# Altium project MAIN.PrjPcb (part 2 of 2)

## Sheet GATE_DRIVER.SchDoc
size A4; SheetNumber: 4; SheetTotal: 6
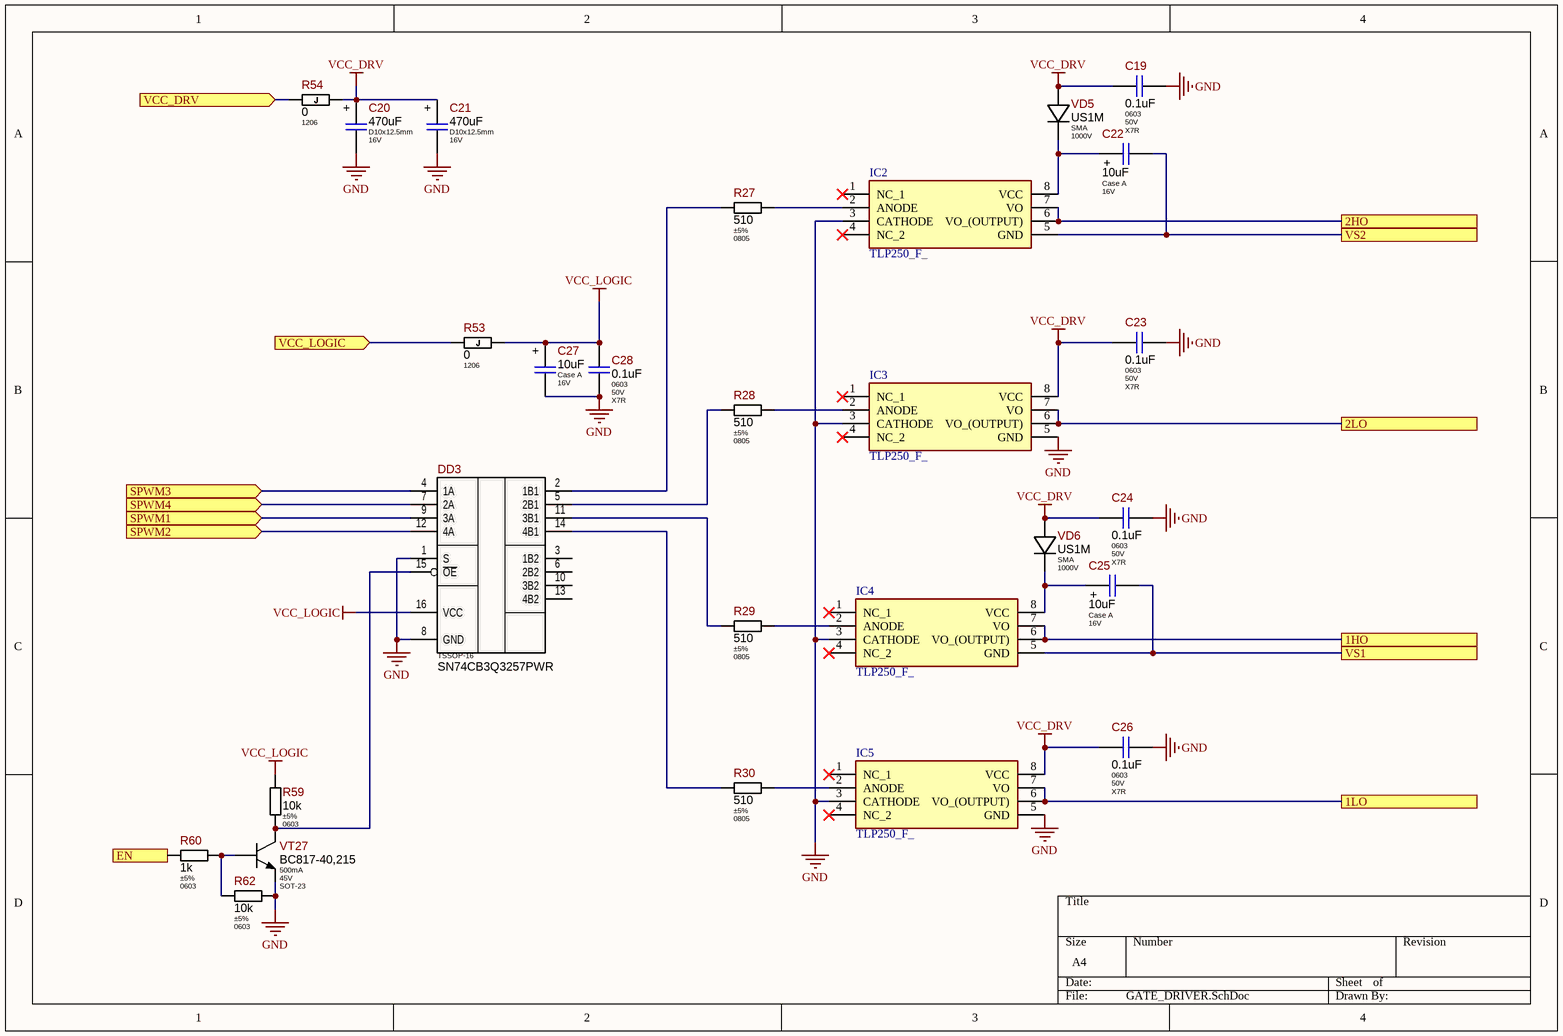
[diagram p3: GATE_DRIVER.SchDoc]

### Parts
C19  Package: 0603  Voltage: 50V  Dielectric Type: X7R  [C_CERAMIC_0603_MED]  (hidden comment: 0.1uF)
C20  value 470uF  Package: D10x12.5mm  Voltage: 16V  [CAP-AE-PTH-100D10x125H15]  (hidden comment: 470uFx16V)
C21  value 470uF  Package: D10x12.5mm  Voltage: 16V  [CAP-AE-PTH-100D10x125H15]  (hidden comment: 470uFx16V)
C22  Package: Case A  Voltage: 16V  [C_TANTAL_CASE_A_MED]  (hidden comment: 10uF)
C23  Package: 0603  Voltage: 50V  Dielectric Type: X7R  [C_CERAMIC_0603_MED]  (hidden comment: 0.1uF)
C24  Package: 0603  Voltage: 50V  Dielectric Type: X7R  [C_CERAMIC_0603_MED]  (hidden comment: 0.1uF)
C25  Package: Case A  Voltage: 16V  [C_TANTAL_CASE_A_MED]  (hidden comment: 10uF)
C26  Package: 0603  Voltage: 50V  Dielectric Type: X7R  [C_CERAMIC_0603_MED]  (hidden comment: 0.1uF)
C27  Package: Case A  Voltage: 16V  [C_TANTAL_CASE_A_MED]  (hidden comment: 10uF)
C28  Package: 0603  Voltage: 50V  Dielectric Type: X7R  [C_CERAMIC_0603_MED]  (hidden comment: 0.1uF)
DD3  SN74CB3Q3257PWR  [TSSOP-16]
IC2  TLP250_F_  [DIP762W60P254L966H485Q8N]
IC3  TLP250_F_  [DIP762W60P254L966H485Q8N]
IC4  TLP250_F_  [DIP762W60P254L966H485Q8N]
IC5  TLP250_F_  [DIP762W60P254L966H485Q8N]
R27  Tolerance: ±5%  Package: 0805  [R_ANY_CHIP_0805_MED]  (hidden comment: 510)
R28  Tolerance: ±5%  Package: 0805  [R_ANY_CHIP_0805_MED]  (hidden comment: 510)
R29  Tolerance: ±5%  Package: 0805  [R_ANY_CHIP_0805_MED]  (hidden comment: 510)
R30  Tolerance: ±5%  Package: 0805  [R_ANY_CHIP_0805_MED]  (hidden comment: 510)
R53  Package: 1206  [R_ANY_CHIP_1206_MED]  (hidden comment: 0)
R54  Package: 1206  [R_ANY_CHIP_1206_MED]  (hidden comment: 0)
R59  Tolerance: ±5%  Package: 0603  [R_ANY_CHIP_0603_MED]  (hidden comment: 10k)
R60  Tolerance: ±5%  Package: 0603  [R_ANY_CHIP_0603_MED]  (hidden comment: 1k)
R62  Tolerance: ±5%  Package: 0603  [R_ANY_CHIP_0603_MED]  (hidden comment: 10k)
VD5  Package: SMA  Voltage: 1000V  [SMA_MED]  (hidden comment: US1M)
VD6  Package: SMA  Voltage: 1000V  [SMA_MED]  (hidden comment: US1M)
VT27  Ic: 500mA  Vce: 45V  Package: SOT-23  [SOT-23_MED]  (hidden comment: BC817-40,215)

### Ports
1HO, 1LO, 2HO, 2LO, EN (in), SPWM1 (in), SPWM2 (in), SPWM3 (in), SPWM4 (in), VCC_DRV (in), VCC_LOGIC (in), VS1, VS2

### Nets
5V: R53.2 ; port VCC_LOGIC
12V: R54.2 ; port VCC_DRV
GND: C19.2 C20.2 C21.2 C23.2 C24.2 C26.2 C27.2 C28.1 DD3.1(S) DD3.8(GND) IC2.3(CATHODE) IC3.3(CATHODE) IC3.5(GND) IC4.3(CATHODE) IC5.3(CATHODE) IC5.5(GND) R62.1 VT27.2(E)
VCC_DRV: C19.1 C20.1 C21.1 C23.1 C24.1 C26.1 IC3.8(VCC) IC5.8(VCC) R54.1 VD5.AN VD6.AN
VCC_LOGIC: C27.1 C28.2 DD3.16(VCC) R53.1 R59.2
NetC22_1: C22.1 IC2.8(VCC) VD5.CA
NetC22_2: C22.2 IC2.5(GND) ; port VS2
NetC25_1: C25.1 IC4.8(VCC) VD6.CA
NetC25_2: C25.2 IC4.5(GND) ; port VS1
NetDD3_2: DD3.2(1B1) R27.1
NetDD3_4: DD3.4(1A) ; port SPWM3
NetDD3_5: DD3.5(2B1) R28.1
NetDD3_7: DD3.7(2A) ; port SPWM4
NetDD3_9: DD3.9(3A) ; port SPWM1
NetDD3_11: DD3.11(3B1) R29.1
NetDD3_12: DD3.12(4A) ; port SPWM2
NetDD3_14: DD3.14(4B1) R30.1
NetDD3_15: DD3.15(~{OE}) R59.1 VT27.3(C)
NetIC2_2: IC2.2(ANODE) R27.2
NetIC2_6: IC2.6(VO_(OUTPUT)) IC2.7(VO) ; port 2HO
NetIC3_2: IC3.2(ANODE) R28.2
NetIC3_6: IC3.6(VO_(OUTPUT)) IC3.7(VO) ; port 2LO
NetIC4_2: IC4.2(ANODE) R29.2
NetIC4_6: IC4.6(VO_(OUTPUT)) IC4.7(VO) ; port 1HO
NetIC5_2: IC5.2(ANODE) R30.2
NetIC5_6: IC5.6(VO_(OUTPUT)) IC5.7(VO) ; port 1LO
NetR60_1: R60.1 ; port EN
NetR60_2: R60.2 R62.2 VT27.1(B)

Not connected (* = marked no-connect by the designer): DD3 3(1B2) 6(2B2) 10(3B2) 13(4B2); IC2 1(NC_1)* 4(NC_2)*; IC3 1(NC_1)* 4(NC_2)*; IC4 1(NC_1)* 4(NC_2)*; IC5 1(NC_1)* 4(NC_2)*

### Notes on the sheet
- (in symbol EXR471M16B) +
- (in symbol TAJA106K016RNJ) +

### Library data of the parts
C19 C23 C24 C26 C28 = CL10B104KB8NNND: 100nF 50V X7R ±10% 0603 Ceramic Capacitor RoHS; Manufacturer: Samsung Electro-Mechanics; Ajax_1C_ID: 21313; Ajax_1C_PN: 100nF 50V X7R 10% 0603 CL10B104KB8NNND ceramic capacitor SMD; Ajax_1С_Status: Substitution; Standard Lead Time: 18 Weeks; Component Status: Released; Replacement: CL10B104KB8NNNC; GUID_1C: f1fd6399-ca68-11ea-ab63-0050569f2651; Value: 0.1uF; Part Number: CL10B104KB8NNND; Part Type: Ceramic / X7R / 0603; Component Type: SMD; Temperature Range: -55°C ~ 125°C; Tolerance: ±10%; ComponentLink1URL: https://media.digikey.com/pdf/Data%20Sheets/Samsung%20PDFs/CL_Series_MLCC_ds.pdf; Supplier 1: Digi-Key; Supplier Part Number 1: CL10B104KB8NNND-ND; Price: 0,0039378; ComponentLink1Description: Datasheet
C20 C21 = EXR471M16B: 470uF 16V D10x12.5mm Electrolytic Low Impedance; Manufacturer: Hitano; Ajax_1C_ID: 15747; Ajax_1C_PN: 470uF 16V 10x12.5mm EXR EXR471M16B-Hitano pcs; Ajax_1С_Status: Mass Production; Standard Lead Time: NONE; Component Status: Released; Tolerance: ±20%; GUID_1C: 3364ee07-6280-11e9-ab4f-0050569f2651; Part Number: EXR471M16B; Part Type: Aluminum; Component Type: PTH; Temperature Range: -40°C ~ 105°C; Dielectric Type: NONE; ComponentLink1URL: https://www.hitano.com.tw/wp-content/uploads/doc/EXR_20200408.pdf; Replacement: NONE; Price: 0,045; ComponentLink1Description: Datasheet
C22 C25 C27 = TAJA106K016RNJ: 10uF 16V ±10% Case A Tantalum Capacitors, 3Ohm; Manufacturer: AVX; Ajax_1C_ID: 6332; Ajax_1C_PN: 10uF 16V case A TAJA106K016RNJ-AVX Ceramic Capacitor SMD RoHS; Ajax_1С_Status: RND Only; Standard Lead Time: 25 Weeks; Component Status: Released; Dielectric Type: NONE; GUID_1C: b7f6d7ac-ecab-11e4-ad28-a45d36c4a9e5; Value: 10uF; Part Number: TAJA106K016RNJ; Part Type: Tantalum; Component Type: SMD; Temperature Range: -55°C ~ 125°C; Tolerance: ±10%; ComponentLink1URL: https://eu.mouser.com/datasheet/2/40/AVXC_S_A0011957049_1-2538439.pdf; Supplier 1: Mouser; Supplier Part Number 1: 581-TAJA106K016R; Replacement: NONE; Price: 0,06584713; ComponentLink1Description: Datasheet
DD3 = SN74CB3Q3257PWR: 4-Bit 1-of-2 FET Multiplexer/Demultiplexer 2.5V/3.3V Low-Voltage High-Bandwidth Bus Switch; Manufacturer: Texas Instruments; Ajax_1C_ID: 9738; Ajax_1C_PN: SN74CB3Q3257PWR микросхема; Ajax_1С_Status: RND Only; Standard Lead Time: 8 Weeks; Component Status: Released; Replacement: NONE; GUID_1C: ccf75652-0f3c-11e7-82d9-d8cb8a9acc66; Package: TSSOP-16; Part Number: SN74CB3Q3257PWR; Part Type: Logic / Multiplexer/Demultiplexer; Component Type: SMD; Temperature Range: -40°C ~ 85°C; ComponentLink1URL: http://www.ti.com/lit/ds/symlink/sn74cb3q3257.pdf; Supplier 1: Digi-Key; Supplier Part Number 1: 296-19138-1-ND; Price: 0,337; ComponentLink1Description: Datasheet
IC2-IC5 = TLP250_F_: Integrated Circuit; Manufacturer_Name: Toshiba; Manufacturer_Part_Number: TLP250(F); Datasheet Link: https://datasheet.datasheetarchive.com/originals/distributors/Datasheets-DGA20/76463.pdf; Height: 4.85mm; Mouser Part Number: 757-TLP250(F); Mouser Price/Stock: https://www.mouser.co.uk/ProductDetail/Toshiba/TLP250F?qs=f0GatGUIxV2cDxQrFeprhQ%3D%3D; Arrow Part Number: TLP250(F); Arrow Price/Stock: https://www.arrow.com/en/products/tlp250-f/toshiba
R27-R30 = CRCW0805510RJNEA: 510 Ohms ±5%, 1/8W 0805 Thick Film Resistor; Manufacturer: Vishay; Ajax_1C_ID: 9454; Ajax_1C_PN: 510R 5% 0805 Resistors SMD RoHS; Ajax_1С_Status: RND Only; Power Rating: 0.125W; Voltage: 150V; Component Status: Released; Temperature Stability: ±200ppm/°C; Replacement: NONE; GUID_1C: 51b8dd24-e3a6-11e6-82a2-d8cb8a9acc66; Value: 510; Part Number: CRCW0805510RJNEA; Component Type: SMD; Part Type: Thick Film; Temperature Range: -55°C ~ 155°C; ComponentLink1URL: https://eu.mouser.com/datasheet/2/427/dcrcwe3-1762152.pdf; Supplier 1: Mouser; Supplier Part Number 1: 71-CRCW0805510RJNEA; Price: 0,09; ComponentLink1Description: Datasheet
R53 R54 = RC1206JR-070RL: 0 Ohms Jumper, 1/4W 1206 Thick Film Resistor; Manufacturer: Yageo; Tolerance: ±5%; Ajax_1C_ID: 5515; Ajax_1C_PN: 0R 5% 1206 Resistors SMD RoHS; Ajax_1С_Status: Mass Production; Power Rating: 0.25W; Voltage: 200V; Component Status: Released; Temperature Stability: NONE; GUID_1C: 96b6e750-6b2e-11e4-9c1d-a45d36c4a9e5; Value: 0; Part Number: RC1206JR-070RL; Component Type: SMD; Part Type: Thick Film; Temperature Range: -55°C ~ 155°C; ComponentLink1URL: https://eu.mouser.com/datasheet/2/447/PYu_RC_Group_51_RoHS_L_10-1664068.pdf; Supplier 1: Digi-Key; Supplier Part Number 1: 311-0.0ERTR-ND; Replacement: NONE; Price: 0,0018; ComponentLink1Description: Datasheet
R59 R62 = RC0603JR-0710KL: 10 kOhms ±5%, 1/10W 0603 Thick Film Resistor; Manufacturer: Yageo; Ajax_1C_ID: 2860; Ajax_1C_PN: 10k 5% 0603 Resistors SMD RoHS; Ajax_1С_Status: Mass Production; Power Rating: 0.1W; Voltage: 75V; Component Status: Released; Temperature Stability: ±100ppm/°C; Replacement: NONE; GUID_1C: df4c2852-e567-11e2-9779-6c626deda1bb; Value: 10k; Part Number: RC0603JR-0710KL; Component Type: SMD; Part Type: Thick Film; Temperature Range: -55°C ~ 155°C; ComponentLink1URL: https://eu.mouser.com/datasheet/2/447/PYu_RC_Group_51_RoHS_L_10-1664068.pdf; Supplier 1: Digi-Key; Supplier Part Number 1: 311-10KGRTR-ND; Price: 0,0006; ComponentLink1Description: Datasheet
R60 = RC0603JR-071KL: 1 kOhms ±5%, 1/10W 0603 Thick Film Resistor; Manufacturer: Yageo; Ajax_1C_ID: 28124; Ajax_1C_PN: 1k 5% 0603 Resistors SMD RoHS; Ajax_1С_Status: Mass Production; Power Rating: 0.1W; Voltage: 75V; Component Status: Released; Temperature Stability: ±100ppm/°C; Replacement: NONE; GUID_1C: fbc5fd6b-8d66-11eb-ab70-0050569f2651; Value: 1k; Part Number: RC0603JR-071KL; Component Type: SMD; Part Type: Thick Film; Temperature Range: -55°C ~ 155°C; ComponentLink1URL: https://eu.mouser.com/datasheet/2/447/PYu_RC_Group_51_RoHS_L_11-1984063.pdf; Supplier 1: Digi-Key; Supplier Part Number 1: 311-1.0KGRTR-ND; Price: 0,00072; ComponentLink1Description: Datasheet
VD5 VD6 = US1M: Diode Standard 1000V 1A, 75ns, SMA; Manufacturer: Diodec Semiconductor; Ajax_1C_ID: 20461; Ajax_1C_PN: US1M-DIO 1.0A 1000V 75ns, диод; Ajax_1С_Status: Mass Production; Component Status: Released; Vf: 1.7V @ 1A; Replacement: NONE; GUID_1C: 3d137b04-96a6-11ea-ab61-0050569f2651; Part Number: US1M; Part Type: General; Component Type: SMD; Marking: US1M; Current: 1A; Temperature Range: -50°C ~ 150°C; ComponentLink1URL: https://diotec.com/request/datasheet/us1a.pdf; Supplier 1: Arrow; Supplier Part Number 1: US1M; Price: 0,02875902; ComponentLink1Description: Datasheet
VT27 = BC817-40,215: 45V, 500mA NPN General Purpose Transistor; Manufacturer: Nexperia USA; Ajax_1C_ID: 6645; Ajax_1C_PN: BC817-40,215 : NPN, sot-23 транзистор; Ajax_1С_Status: Mass Production; Component Status: Released; Standard Lead Time: 4 Weeks; Replacement: NONE; GUID_1C: 5d499e81-0f64-11e5-ad28-a45d36c4a9e5; Part Number: BC817-40,215; Part Type: NPN; Component Type: SMD; Temperature Range: -65°C ~ 150°C; ComponentLink1URL: https://eu.mouser.com/datasheet/2/916/BC817_SER-1480622.pdf; Supplier 1: Mouser; Supplier Part Number 1: 771-BC817-40-T/R; Price: 0,094; ComponentLink1Description: Datasheet

## Sheet REVERSE_POLARITY_PROT.SchDoc: =DocumentName
size A4; Author: Starovit; CompanyName: "AS Manufacturing" LLC; Organization: "AS Manufacturing" LLC; Address1: 5 Sklyarenka St.; Address2: Kyiv 04073; Address3: Ukraine; Address4: https://ajax.systems/en/; Revision: v1; SheetNumber: 5; SheetTotal: 8; Product name: INVERTOR; Internal reference: 001; Head: INVERTOR.001.v1; PCB_Designator: INVERTOR.001.v1; Template_version: 1.0.1
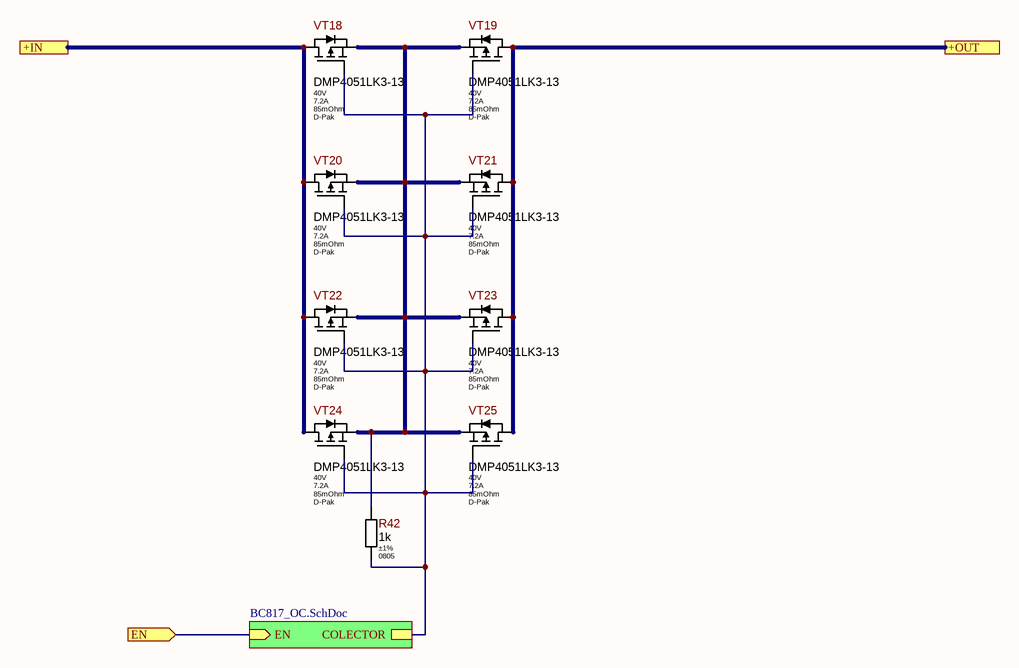
[diagram p4: REVERSE_POLARITY_PROT.SchDoc]

### Parts
R42  Tolerance: ±1%  Package: 0805  [R_ANY_CHIP_0805_MED]  (hidden comment: 1k)
VT18  Vds: 40V  Id: 7.2A  Rds: 85mOhm  Package: D-Pak  [DPAK_REC]  (hidden comment: DMP4051LK3-13)
VT19  Vds: 40V  Id: 7.2A  Rds: 85mOhm  Package: D-Pak  [DPAK_REC]  (hidden comment: DMP4051LK3-13)
VT20  Vds: 40V  Id: 7.2A  Rds: 85mOhm  Package: D-Pak  [DPAK_REC]  (hidden comment: DMP4051LK3-13)
VT21  Vds: 40V  Id: 7.2A  Rds: 85mOhm  Package: D-Pak  [DPAK_REC]  (hidden comment: DMP4051LK3-13)
VT22  Vds: 40V  Id: 7.2A  Rds: 85mOhm  Package: D-Pak  [DPAK_REC]  (hidden comment: DMP4051LK3-13)
VT23  Vds: 40V  Id: 7.2A  Rds: 85mOhm  Package: D-Pak  [DPAK_REC]  (hidden comment: DMP4051LK3-13)
VT24  Vds: 40V  Id: 7.2A  Rds: 85mOhm  Package: D-Pak  [DPAK_REC]  (hidden comment: DMP4051LK3-13)
VT25  Vds: 40V  Id: 7.2A  Rds: 85mOhm  Package: D-Pak  [DPAK_REC]  (hidden comment: DMP4051LK3-13)

### Sub-sheets
OC = BC817_OC.SchDoc (file not in this document): EN (in), COLECTOR

### Ports
+IN, +OUT, EN (in)

### Nets
+V_BRIDGE: VT19.2(D) VT21.2(D) VT23.2(D) VT25.2(D) ; port +OUT
+VBAT: VT18.2(D) VT20.2(D) VT22.2(D) VT24.2(D) ; port +IN
cEN_BRIDGE_POWER: port EN, sheet OC/EN
NetR42_1: R42.1 VT18.1(G) VT19.1(G) VT20.1(G) VT21.1(G) VT22.1(G) VT23.1(G) VT24.1(G) VT25.1(G) ; sheet OC/COLECTOR
NetR42_2: R42.2 VT18.3(S) VT19.3(S) VT20.3(S) VT21.3(S) VT22.3(S) VT23.3(S) VT24.3(S) VT25.3(S)

### Notes on the sheet
- Title
- Product:
- Project:
- Size:
- Date:
- Variant:
- A4
- Authors:
- Time:
- Sheet
- of
- Revision:
- @Vitech_ua
- Commit:

### Library data of the parts
R42 = RC0805FR-071KL: 1 kOhms ±1%, 1/8W 0805 Thick Film Resistor; Manufacturer: Yageo; Ajax_1C_ID: 8520; Ajax_1C_PN: 1k 1% 0805 Resistors SMD RoHS; Ajax_1С_Status: Mass Production; Power Rating: 0.125W; Voltage: 150V; Component Status: Released; Temperature Stability: ±100ppm/°C; Replacement: NONE; GUID_1C: 0c53a8ec-2890-11e6-81ae-d8cb8a9acc66; Value: 1k; Part Number: RC0805FR-071KL; Component Type: SMD; Part Type: Thick Film; Temperature Range: -55°C ~ 155°C; ComponentLink1URL: https://eu.mouser.com/datasheet/2/447/PYu_RC_Group_51_RoHS_L_10-1664068.pdf; Supplier 1: Digi-Key; Supplier Part Number 1: 311-1.00KCRTR-ND; Price: 0,0014; ComponentLink1Description: Datasheet
VT18-VT25 = DMP4051LK3-13: -40V, -7.2A max P-Channel Enhancement MOSFET, 59mOhm @ Vgs = -4.5V; Manufacturer: Diodes Incorporated; Ajax_1C_ID: 18605; Ajax_1C_PN: DMP4051LK3 40V, 0,05Ohm P-chanel Power HEXFET; Ajax_1С_Status: Mass Production; Component Status: Released; Standard Lead Time: 30 Weeks; Replacement: NONE; GUID_1C: 9abe91dd-36a9-11ea-ab5a-0050569f2651; Part Number: DMP4051LK3-13; Part Type: P-Channel; Component Type: SMD; Temperature Range: -55°C ~ 150°C; ComponentLink1URL: https://www.diodes.com/assets/Datasheets/DMP4051LK3.pdf; Supplier 1: Digi-Key; Supplier Part Number 1: DMP4051LK3-13DITR-ND; Price: 0,1628; ComponentLink1Description: Datasheet

## Sheet EXT_U_DET.SchDoc: =DocumentName
size A4; Author: Starovit; CompanyName: "AS Manufacturing" LLC; Organization: "AS Manufacturing" LLC; Address1: 5 Sklyarenka St.; Address2: Kyiv 04073; Address3: Ukraine; Address4: https://ajax.systems/en/; Revision: v1; SheetNumber: 6; SheetTotal: 7; Product name: INVERTOR; Internal reference: 001; Head: INVERTOR.001.v1; PCB_Designator: INVERTOR.001.v1; Template_version: 1.0.1
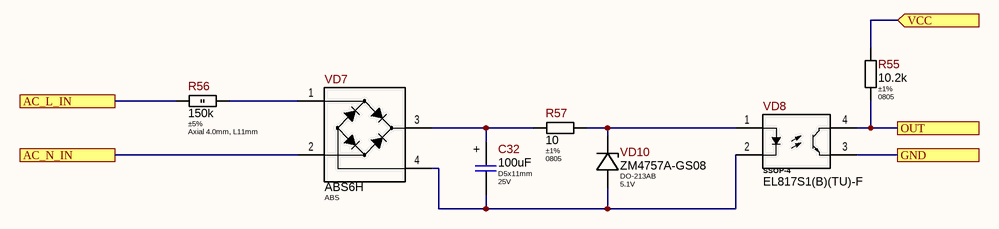
[diagram p5: EXT_U_DET.SchDoc]

### Parts
C32  value 100uF  Package: D5x11mm  Voltage: 25V  [CAP-AE-PTH-50D05x110H15]  (hidden comment: 100uFx25V)
R55  Tolerance: ±1%  Package: 0805  [R_ANY_CHIP_0805_MED]  (hidden comment: 10.2k)
R56  Tolerance: ±5%  Package: Axial 4.0mm, L11mm  [MOR200S-Series]  (hidden comment: 150k)
R57  Tolerance: ±1%  Package: 0805  [R_ANY_CHIP_0805_MED]  (hidden comment: 10)
VD7  Package: ABS  [ABSxx-Series]  (hidden comment: ABS6H)
VD8  Package: SSOP-4  [EL-817S1-(x)(xx)]  (hidden comment: EL817S1(B)(TU)-F)
VD10  Voltage: 5.1V  [DO-213AB]  (hidden comment: ZM4757A-GS08)

### Ports
AC_L_IN, AC_N_IN, GND, OUT, VCC (in)

### Nets
3V3: R55.1 ; port VCC
GND: VD8.3(Emitter) ; port GND
dEXT_U_DET: R55.2 VD8.4(Collector) ; port OUT
EXT_AC_L: R56.1 ; port AC_L_IN
EXT_AC_N: VD7.2 ; port AC_N_IN
NetC32_1: C32.1 R57.1 VD7.3(+)
NetC32_2: C32.2 VD7.4(-) VD8.2(Cathode) VD10.AN
NetR56_2: R56.2 VD7.1
NetR57_2: R57.2 VD8.1(Anode) VD10.CA

### Notes on the sheet
- Title
- Product:
- Project:
- Size:
- Date:
- Variant:
- A4
- Authors:
- Time:
- Sheet
- of
- Revision:
- @Vitech_ua
- Commit:
- (in symbol KRM-025V101MC110-T/A2) +

### Library data of the parts
C32 = KRM-025V101MC110-T/A2: 100uF 25V ±20% D5x11mm 105℃ Aluminum Electrolytic Capacitor; Manufacturer: Koshin; Ajax_1C_ID: 55676; Ajax_1C_PN: 100uF 25V 20% 5x11mm KRM-025V101MC110-T/A2 Koshin Capacitors SMD RoHS; Ajax_1С_Status: RND Only; Standard Lead Time: NONE; Component Status: Released; GUID_1C: cc76a443-6c07-11ed-a366-005056994834; Part Number: KRM-025V101MC110-T/A2; Part Type: Aluminum; Component Type: PTH; Temperature Range: -40°C ~ 105°C; Tolerance: ±20%; Dielectric Type: NONE; ComponentLink1URL: \\altiumdb.ajax.local\files\Datasheet\Capacitor\Koshin - KRM Series.pdf; Replacement: NONE; Price: 0; ComponentLink1Description: Datasheet
R55 = RC0805FR-0710K2L: 10.2 kOhms ±1%, 1/8W 0805 Thick Film Resistor; Manufacturer: Yageo; Ajax_1C_ID: 13943; Ajax_1C_PN: 10.2k 1% 0805 Resistors SMD RoHS; Ajax_1С_Status: Mass Production; Power Rating: 0.125W; Voltage: 150V; Component Status: Released; Temperature Stability: ±100ppm/°C; Replacement: NONE; GUID_1C: 8bc9d0ce-c58a-11e8-ab47-0050569f2651; Value: 10.2k; Part Number: RC0805FR-0710K2L; Component Type: SMD; Part Type: Thick Film; Temperature Range: -55°C ~ 155°C; ComponentLink1URL: https://eu.mouser.com/datasheet/2/447/PYu_RC_Group_51_RoHS_L_10-1664068.pdf; Supplier 1: Digi-Key; Supplier Part Number 1: 311-10.2KCRTR-ND; Price: 0,0014; ComponentLink1Description: Datasheet
R56 = MOR200SJTB-10R: 150k Ohm ±5%, 2W d4.0mm L11mm Axial Through Hole, Metal Oxide Resistor, Al2O3; Manufacturer: Hitano; Ajax_1C_ID: 17914; Ajax_1C_PN: 150k 5% 2W (MOR200SJTB-10R-Hitano) резистор выводной pcs; Ajax_1С_Status: RND Only; Voltage: 500V; Component Status: Released; Temperature Stability: ±250ppm/°C; Replacement: NONE; GUID_1C: 857e103f-078d-11ea-ab58-0050569f2651; Value: 150k; Part Number: MOR200SJTB-10R; Component Type: PTH; Part Type: Metal Oxide Film; Power Rating: 2W; Temperature Range: -55°C ~ 200°C; ComponentLink1URL: \\altiumdb.ajax.local\files\Datasheet\Passive\MOR_20160329.pdf; Supplier 1: RKS; Supplier Part Number 1: 13878; Price: 0,05250406; ComponentLink1Description: Datasheet
R57 = RC0805FR-0710RL: 10 Ohms ±1%, 1/8W 0805 Thick Film Resistor; Manufacturer: Yageo; Ajax_1C_ID: 9628; Ajax_1C_PN: 10R 1% 0805 Resistors SMD RoHS; Ajax_1С_Status: Mass Production; Power Rating: 0.125W; Voltage: 150V; Component Status: Released; Temperature Stability: ±200ppm/°C; Replacement: NONE; GUID_1C: 1aa18cd2-0589-11e7-82cd-d8cb8a9acc66; Value: 10; Part Number: RC0805FR-0710RL; Component Type: SMD; Part Type: Thick Film; Temperature Range: -55°C ~ 155°C; ComponentLink1URL: https://eu.mouser.com/datasheet/2/447/PYu_RC_Group_51_RoHS_L_10-1664068.pdf; Supplier 1: Digi-Key; Supplier Part Number 1: 311-10.0CRTR-ND; Price: 0,0014; ComponentLink1Description: Datasheet
VD7 = ABS6H: 1A, 600V Standard Bridge Rectifier, ABS Package; Manufacturer: Taiwan Semiconductor; Ajax_1C_ID: 34652; Ajax_1C_PN: ABS6H 600V 1A Bridge Rectifier LGE ABS; Ajax_1С_Status: RND Only; Component Status: Released; Vf: 0.95V @ 0.4A; Replacement: NONE; GUID_1C: 734c9af7-1f64-11ec-ab76-0050569f2651; Part Number: ABS6H; Part Type: Array; Component Type: SMD; Marking: ABS6H; Current: 1A; Voltage: 600V; Temperature Range: -55°C ~ 150°C; ComponentLink1URL: \\altiumdb.ajax.local\files\Datasheet\Diodes\ABS2 SERIES_M2103.pdf; Supplier 1: Mouser; Supplier Part Number 1: 821-ABS6H; Price: 0,0254; ComponentLink1Description: Datasheet
VD8 = EL817S1(B)(TU)-F: 1-Channel Photocoupler, 5kV, 130-260% CTR, SSOP-4; Manufacturer: Everlight Electronics; Ajax_1C_ID: 34526; Ajax_1C_PN: EL817S1(B)(TU)-F Optocoupler IC Everlight SMD-4; Ajax_1С_Status: RND Only; Component Status: On Review; Wavelength: NONE; GUID_1C: 2965953f-1c55-11ec-ab76-0050569f2651; ComponentLink1URL: \\altiumdb.ajax.local\files\Datasheet\Opto\el817-Everlight.pdf; ComponentLink1Description: Datasheet; Part Number: EL817S1(B)(TU)-F; Part Type: Optocoupler; Component Type: SMD; Color: NONE; Temperature Range: -55°C ~ 110°C; Supplier 1: Arrow; Supplier Part Number 1: EL817S1(B)(TU)-F; Replacement: NONE; Price: 0,04209091
VD10 = ZM4757A-GS08: Zener Diode 5.1V, 1W, ±5%, 5uA Reverse Current, DO-213AB; Manufacturer: Vishay Semiconductor; Ajax_1C_ID: 43362; Ajax_1C_PN: ZM4757A-GS08 стабилитрон 2,6*5,2 51V 1W; Ajax_1С_Status: Mass Production; Component Status: Released; Standard Lead Time: 27 Weeks; Replacement: NONE; GUID_1C: ea8fe24c-db72-11ec-a361-005056994834; Part Number: ZM4757A-GS08; Package: DO-213AB; Part Type: Zener; Component Type: SMD; Temperature Range: -65°C ~ 175°C; ComponentLink1URL: https://eu.mouser.com/datasheet/2/427/zm4728a-1767906.pdf; Supplier 1: Mouser; Supplier Part Number 1: 625-ZM4757A; Price: 0,07370924; ComponentLink1Description: Datasheet

## Sheet OCP.SchDoc
size A4; SheetNumber: 7; SheetTotal: 7
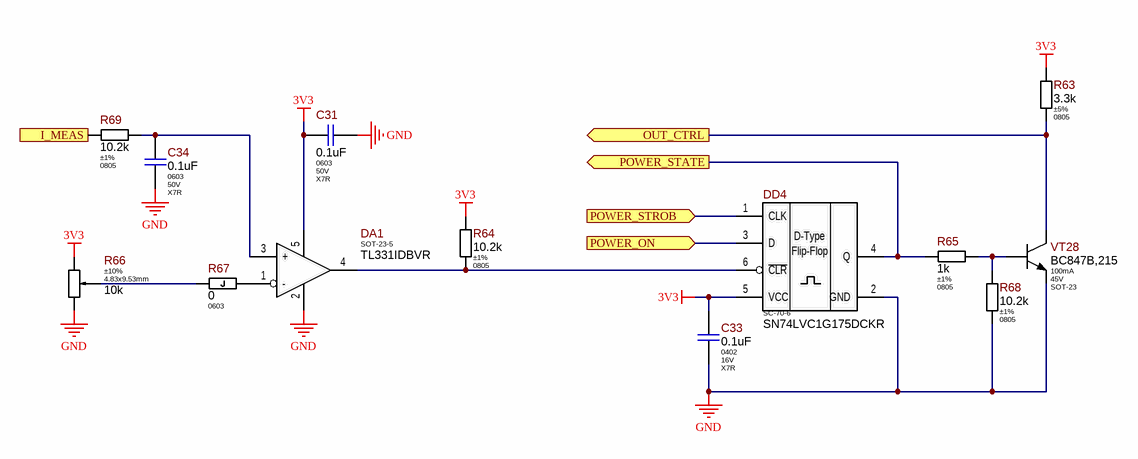
[diagram p6: OCP.SchDoc]

### Parts
C31  Package: 0603  Voltage: 50V  Dielectric Type: X7R  [C_CERAMIC_0603_MED]  (hidden comment: 0.1uF)
C33  Package: 0402  Voltage: 16V  Dielectric Type: X7R  [C_CERAMIC_0402_MED]  (hidden comment: 0.1uF)
C34  Package: 0603  Voltage: 50V  Dielectric Type: X7R  [C_CERAMIC_0603_MED]  (hidden comment: 0.1uF)
DA1  TL331IDBVR  [SOT-23-5]
DD4  SN74LVC1G175DCKR  [SC-70-6]
R63  Tolerance: ±5%  Package: 0805  [R_ANY_CHIP_0805_MED]  (hidden comment: 3.3k)
R64  Tolerance: ±1%  Package: 0805  [R_ANY_CHIP_0805_MED]  (hidden comment: 10.2k)
R65  Tolerance: ±1%  Package: 0805  [R_ANY_CHIP_0805_MED]  (hidden comment: 1k)
R66  Tolerance: ±10%  Package: 4.83x9.53mm  [3296W-1-xxx]  (hidden comment: 10k)
R67  Package: 0603  [R_ANY_CHIP_0603_MED]  (hidden comment: 0)
R68  Tolerance: ±1%  Package: 0805  [R_ANY_CHIP_0805_MED]  (hidden comment: 10.2k)
R69  Tolerance: ±1%  Package: 0805  [R_ANY_CHIP_0805_MED]  (hidden comment: 10.2k)
VT28  Part Number: BC847B,215  Ic: 100mA  Vce: 45V  Package: SOT-23  [SOT-23_MED]  (hidden comment: BC847B)

### Ports
I_MEAS (out), OUT_CTRL (out), POWER_ON (in), POWER_STATE (out), POWER_STROB (in)

### Nets
3V3: C31.2 C33.1 DA1.5(VCC) DD4.5(VCC) R63.1 R64.2 R66.1(CCW)
GND: C31.1 C33.2 C34.2 DA1.2(GND) DD4.2(GND) R66.3(CW) R68.1 VT28.2(E)
cPOWER_EN: DD4.3(D) ; port POWER_ON
cPOWER_STROB: DD4.1(CLK) ; port POWER_STROB
dPOWER_STATE: DD4.4(Q) R65.1 ; port POWER_STATE
EN_PWM_OCP: R63.2 VT28.3(C) ; port OUT_CTRL
xMEAS_CURRENT: R69.2 ; port I_MEAS
NetC34_1: C34.1 DA1.3(+) R69.1
NetDA1_1: DA1.1(-) R67.1
NetDA1_4: DA1.4(OUT) DD4.6(~{CLR}) R64.1
NetR65_2: R65.2 R68.2 VT28.1(B)
NetR66_2: R66.2(WIPER) R67.2

### Notes on the sheet
- (in symbol SN74LVC1G175DCKR) D-Type; Flip-Flop

### Library data of the parts
C31 C34 = CL10B104KB8NNND: as C19 on sheet GATE_DRIVER; Value: 0.1uF; Part Number: CL10B104KB8NNND; Part Type: Ceramic / X7R / 0603; Component Type: SMD; Temperature Range: -55°C ~ 125°C; Tolerance: ±10%; ComponentLink1URL: https://media.digikey.com/pdf/Data%20Sheets/Samsung%20PDFs/CL_Series_MLCC_ds.pdf; Supplier 1: Digi-Key; Supplier Part Number 1: CL10B104KB8NNND-ND; Price: 0,0039378; ComponentLink1Description: Datasheet
C33 = CC0402KPX7R7BB104: 100nF 16V X7R ±10% 0402 Ceramic Capacitor RoHS; Manufacturer: Yageo; Ajax_1C_ID: 24373; Ajax_1C_PN: 100nF 16V X7R 10% 0402 CC0402KPX7R7BB104 Ceramic Capacitor SMD RoHS; Standard Lead Time: 20 Weeks; Replacement: CC0402KRX7R7BB104; Ajax_1С_Status: Mass Production; Component Status: Released; GUID_1C: f08a0794-308d-11eb-ab6e-0050569f2651; Value: 0.1uF; Part Number: CC0402KPX7R7BB104; Part Type: Ceramic / X7R / 0402; Component Type: SMD; Temperature Range: -55°C ~ 125°C; Tolerance: ±10%; ComponentLink1URL: https://eu.mouser.com/datasheet/2/447/UPY_NP0X5R_01005_4V_to_25V_V10-3003057.pdf; Supplier 1: Mouser; Supplier Part Number 1: 603-CC402KPX7R7BB104; ComponentLink1Description: Datasheet; Price: 0.0013
DA1 = TL331IDBVR: Up to 36V, Single Comparator, Open Collector Output, 700uA Supply Current, SOT-23-5; Manufacturer: Texas Instruments; Ajax_1C_PN: NONE; Ajax_1С_Status: RND Only; Standard Lead Time: 45 Weeks; Component Status: Released; Package: SOT-23-5; Part Number: TL331IDBVR; Part Type: Comparator; Component Type: SMD; Temperature Range: -40°C ~ 105°C; ComponentLink1URL: https://www.ti.com/lit/ds/symlink/tl391b.pdf; Supplier 1: Mouser; Supplier Part Number 1: 595-TL331IDBVR; Replacement: NONE; Price: NONE; ComponentLink1Description: Datasheet
DD4 = SN74LVC1G175DCKR: Single D-type Flip-Flop with Asynchronous Clear, Positive Edge Trigger, SC-70-6; Manufacturer: Texas Instruments; Ajax_1C_ID: 25389; Ajax_1C_PN: SN74LVC1G175DCKR (SC70-6) микросхема; Standard Lead Time: 6 Weeks; Replacement: NONE; Ajax_1С_Status: RND Only; Component Status: Released; GUID_1C: 0fcd2c69-53fe-11eb-ab6e-0050569f2651; Package: SC-70-6; Part Number: SN74LVC1G175DCKR; Part Type: Logic / Flip-Flop; Component Type: SMD; Temperature Range: -40°C ~ 125°C; ComponentLink1URL: https://www.ti.com/lit/ds/symlink/sn74lvc1g175.pdf; Supplier 1: Digi-Key; Supplier Part Number 1: 296-16998-2-ND; ComponentLink1Description: Datasheet; Price: 0,0382
R63 = RC0805JR-073K3L: 3.3 kOhms ±5%, 1/8W 0805 Thick Film Resistor; Manufacturer: Yageo; Ajax_1C_ID: 9030; Ajax_1C_PN: 3.3k 5% 0805 Resistors SMD RoHS; Ajax_1С_Status: RND Only; Power Rating: 0.125W; Voltage: 150V; Component Status: Released; Temperature Stability: ±100ppm/°C; Replacement: NONE; GUID_1C: cb9785ec-9b47-11e6-8242-d8cb8a9acc66; Value: 3.3k; Part Number: RC0805JR-073K3L; Component Type: SMD; Part Type: Thick Film; Temperature Range: -55°C ~ 155°C; ComponentLink1URL: https://eu.mouser.com/datasheet/2/447/PYu_RC_Group_51_RoHS_L_10-1664068.pdf; Price: 0,001081; ComponentLink1Description: Datasheet
R64 R68 R69 = RC0805FR-0710K2L: as R55 on sheet EXT_U_DET; Value: 10.2k; Part Number: RC0805FR-0710K2L; Component Type: SMD; Part Type: Thick Film; Temperature Range: -55°C ~ 155°C; ComponentLink1URL: https://eu.mouser.com/datasheet/2/447/PYu_RC_Group_51_RoHS_L_10-1664068.pdf; Supplier 1: Digi-Key; Supplier Part Number 1: 311-10.2KCRTR-ND; Price: 0,0014; ComponentLink1Description: Datasheet
R65 = RC0805FR-0710K2L: 1 kOhms ±1%, 1/8W 0805 Thick Film Resistor; Manufacturer: Yageo; Ajax_1C_ID: 13943; Ajax_1C_PN: 10.2k 1% 0805 Resistors SMD RoHS; Ajax_1С_Status: Mass Production; Power Rating: 0.125W; Voltage: 150V; Component Status: Released; Temperature Stability: ±100ppm/°C; Replacement: NONE; GUID_1C: 8bc9d0ce-c58a-11e8-ab47-0050569f2651; Value: 1k; Part Number: RC0805FR-0710K2L; Component Type: SMD; Part Type: Thick Film; Temperature Range: -55°C ~ 155°C; ComponentLink1URL: https://eu.mouser.com/datasheet/2/447/PYu_RC_Group_51_RoHS_L_10-1664068.pdf; Supplier 1: Digi-Key; Supplier Part Number 1: 311-10.2KCRTR-ND; Price: 0,0014; ComponentLink1Description: Datasheet
R66 = 3296W-1-103LF: 10 kOhms ±10% Trimmer Resistor, 0.5W, Through Hole 3/8", 4.83x9.53mm, 10.03mm Height; Manufacturer: Bourns; Ajax_1C_PN: NONE; Ajax_1С_Status: RND Only; Component Status: On Review; Temperature Stability: ±100ppm/°C; Value: 10k; Part Number: 3296W-1-103LF; Component Type: PTH; Part Type: Trimming Potentiometer; Power Rating: 0.5W; Temperature Range: -55°C ~ 125°C; ComponentLink1URL: https://www.bourns.com/data/global/pdfs/3296.pdf; Supplier 1: Mouser; Supplier Part Number 1: 652-3296W-1-103LF; Replacement: NONE; Price: NONE; ComponentLink1Description: Datasheet
R67 = RC0603JR-070RL: 0 Ohms Jumper, 1/10W 0603 Thick Film Resistor; Manufacturer: Yageo; Tolerance: ±5%; Ajax_1C_ID: 2857; Ajax_1C_PN: 0R 5% 0603 Resistors SMD RoHS; Ajax_1С_Status: Mass Production; Power Rating: 0.1W; Voltage: 75V; Component Status: Released; Temperature Stability: NONE; GUID_1C: df4c284c-e567-11e2-9779-6c626deda1bb; Value: 0; Part Number: RC0603JR-070RL; Component Type: SMD; Part Type: Thick Film; Temperature Range: -55°C ~ 155°C; ComponentLink1URL: https://eu.mouser.com/datasheet/2/447/PYu_RC_Group_51_RoHS_L_10-1664068.pdf; Supplier 1: Digi-Key; Supplier Part Number 1: 311-0.0GRTR-ND; Replacement: NONE; Price: 0,0006; ComponentLink1Description: Datasheet
VT28 = BC847B,215: 45V, 100mA NPN General Purpose Transistor; Manufacturer: Nexperia USA; Ajax_1C_PN: BC847B,215 transistor; Standard Lead Time: 4 Weeks; Replacement: NONE; Ajax_1C_ID: 32205; Ajax_1С_Status: RND Only; Component Status: Released; GUID_1C: d2f86895-eaea-11eb-ab74-0050569f2651; Part Type: NPN; Component Type: SMD; Temperature Range: -65°C ~ 150°C; ComponentLink1URL: https://assets.nexperia.com/documents/data-sheet/BC847_SER.pdf; Supplier 1: Digi-Key; Supplier Part Number 1: 1727-2921-2-ND; ComponentLink1Description: Datasheet; Price: 0,069

## Nets that join several sheets
3V3: main (C2.1 DA2.5 R5.2), STEP_DOWN (C4A.1 C5A.1 HG1A.AN L1A.2), EXT_U_DET (R55.1), OCP (7 pins)
5V: main (R8.2 X8.1), STEP_DOWN (C4B.1 C5B.1 HG1B.AN L1B.2), EG8010 (14 pins), GATE_DRIVER (R53.2)
12V: main (C16.2 FB2.1), STEP_DOWN (C3A.1 C17A.2 D1A.3 R3A.1), STEP_DOWN (C3B.1 C17B.2 D1B.3 R3B.1), GATE_DRIVER (R54.2)
+V_BRIDGE: main (7 pins), REVERSE_POLARITY_PROT (VT19.2 VT21.2 VT23.2 VT25.2)
+VBAT: main (F1.1 F2.1 K2.5 VD12.AN), REVERSE_POLARITY_PROT (VT18.2 VT20.2 VT22.2 VT24.2)
GND: main (23 pins), STEP_DOWN (8 pins), STEP_DOWN (8 pins), EG8010 (31 pins), GATE_DRIVER (18 pins), EXT_U_DET (VD8.3), OCP (8 pins)
cEN_UART_EG: main (X3.11), EG8010 (R32.1)
cPOWER_EN: main (X3.6), OCP (DD4.3)
cPOWER_STROB: main (X3.4), OCP (DD4.1)
dEXT_U_DET: main (X3.2), EXT_U_DET (R55.2 VD8.4)
dPOWER_STATE: main (X3.8), OCP (DD4.4 R65.1)
DT0: main (X3.13), EG8010 (R10.1)
DT1: main (X3.15), EG8010 (R13.1)
EG_RX: main (X3.7), EG8010 (DD1.2)
EG_TX: main (X3.9), EG8010 (DD2.4)
EN_PWM: main (VD11.CA X3.5), EG8010 (IC1.6)
EN_PWM_OCP: main (VD13.CA), OCP (R63.2 VT28.3)
EXT_AC_L: main (K1.7 K1.8 X7.2), EXT_U_DET (R56.1)
EXT_AC_N: main (X4.1 X7.1 X12.1), EXT_U_DET (VD7.2)
FQSEL: main (X3.14), EG8010 (R19.1)
NetC22_2: main (8 pins), GATE_DRIVER (C22.2 IC2.5)
NetC25_2: main (8 pins), GATE_DRIVER (C25.2 IC4.5)
NetD1A_4: main (R5.1), STEP_DOWN (D1A.4 R6A.1)
NetD1B_4: main (R8.1), STEP_DOWN (D1B.4 R6B.1)
NetDD3_4: EG8010 (IC1.29), GATE_DRIVER (DD3.4)
NetDD3_7: EG8010 (IC1.30), GATE_DRIVER (DD3.7)
NetDD3_9: EG8010 (IC1.27), GATE_DRIVER (DD3.9)
NetDD3_12: EG8010 (IC1.28), GATE_DRIVER (DD3.12)
NetIC2_6: main (R38.1 R39.1 R40.1 R41.2), GATE_DRIVER (IC2.6 IC2.7)
NetIC3_6: main (R45.1 R47.1 R49.1 R51.2), GATE_DRIVER (IC3.6 IC3.7)
NetIC4_6: main (R34.1 R35.1 R36.1 R37.2), GATE_DRIVER (IC4.6 IC4.7)
NetIC5_6: main (R46.1 R48.1 R50.1 R52.2), GATE_DRIVER (IC5.6 IC5.7)
NetR60_1: main (VD11.AN VD13.AN), GATE_DRIVER (R60.1)
SST: main (X3.16), EG8010 (R16.1)
xMEAS_CURRENT: main (C18.1 R43.2 X3.3), OCP (R69.2)